# Altium schematic sheet BOWIE_MCU.SchDoc
size A; SheetNumber: 4; SheetTotal: 8
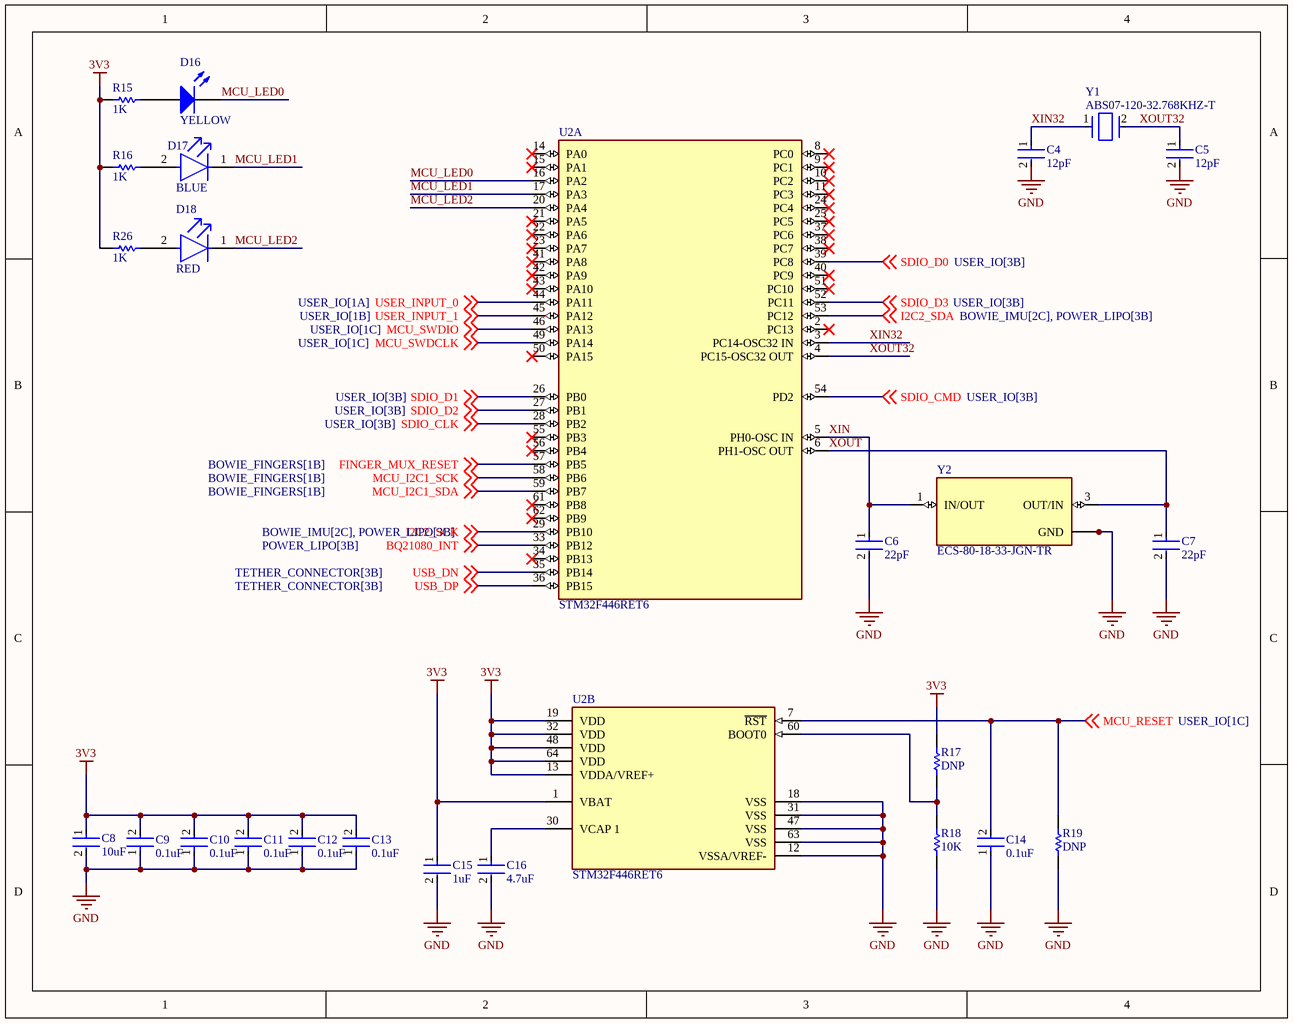
[diagram p0: BOWIE_MCU.SchDoc]

## Parts
C4  12pF  [FP-0402-L_1_0_1-W_0_5_0_1-IPC_B]
C5  12pF  [FP-0402-L_1_0_1-W_0_5_0_1-IPC_B]
C6  22pF  [FP-0402-L_1_0_1-W_0_5_0_1-MFG]
C7  22pF  [FP-0402-L_1_0_1-W_0_5_0_1-MFG]
C8  10uF  [FP-CL05A106MP5NUNC-MFG]
C9  0.1uF  [FP-CC0201-BA-MFG]
C10  0.1uF  [FP-CC0201-BA-MFG]
C11  0.1uF  [FP-CC0201-BA-MFG]
C12  0.1uF  [FP-CC0201-BA-MFG]
C13  0.1uF  [FP-CC0201-BA-MFG]
C14  0.1uF  [FP-CC0201-BA-MFG]
C15  1uF  [FP-CL511-IPC_C]
C16  4.7uF  [FP-C1005-050-0_15-MFG]
D16  YELLOW  [0603_A]
D17  BLUE  [FP-LTST-C191TBKT-MFG]
D18  RED  [FP-SML-P11UTT86-MFG]
R15  1K  [RESC1005X40X25NL05T05]
R16  1K  [RESC1005X40X25NL05T05]
R17  DNP  [RESC1005X40X25ML05T10]
R18  10K  [RESC1005X40X25ML05T10]
R19  DNP  [RESC1005X40X25NL05T10]
R26  1K  [RESC1005X40X25NL05T05]
U2  STM32F446RET6  [FP-LQFP64-5W-MFG]  (parts A,B of 2)
Y1  ABS07-120-32.768KHZ-T  [FP-ABS07-120-MFG]
Y2  ECS-80-18-33-JGN-TR  [XTAL_ECS-240-8-33-AGN-TR]

## Nets
3V3: C8.1 C9.2 C10.2 C11.2 C12.2 C13.2 C15.1 R15.1 R16.1 R17.2 R26.1 U2.1(VBAT) U2.13(VDDA/VREF+) U2.19(VDD) U2.32(VDD) U2.48(VDD) U2.64(VDD)
GND: C4.2 C5.2 C6.2 C7.2 C8.2 C9.1 C10.1 C11.1 C12.1 C13.1 C14.1 C15.2 C16.2 R18.1 R19.1 U2.12(VSSA/VREF-) U2.18(VSS) U2.31(VSS) U2.47(VSS) U2.63(VSS) Y2.2(GND) Y2.4(GND)
BQ21080_INT: U2.33(PB12) ; off-sheet BQ21080_INT
FINGER_MUX_RESET: U2.57(PB5) ; off-sheet FINGER_MUX_RESET
I2C2_SCK: U2.29(PB10) ; off-sheet I2C2_SCK
I2C2_SDA: U2.53(PC12) ; off-sheet I2C2_SDA
MCU_I2C1_SCK: U2.58(PB6) ; off-sheet MCU_I2C1_SCK
MCU_I2C1_SDA: U2.59(PB7) ; off-sheet MCU_I2C1_SDA
MCU_LED0: D16.1(K) U2.16(PA2)
MCU_LED1: D17.1(C) U2.17(PA3)
MCU_LED2: D18.1(C) U2.20(PA4)
MCU_RESET: C14.2 R19.2 U2.7(~{RST}) ; off-sheet MCU_RESET
MCU_SWDCLK: U2.49(PA14) ; off-sheet MCU_SWDCLK
MCU_SWDIO: U2.46(PA13) ; off-sheet MCU_SWDIO
SDIO_CLK: U2.28(PB2) ; off-sheet SDIO_CLK
SDIO_CMD: U2.54(PD2) ; off-sheet SDIO_CMD
SDIO_D0: U2.39(PC8) ; off-sheet SDIO_D0
SDIO_D1: U2.26(PB0) ; off-sheet SDIO_D1
SDIO_D2: U2.27(PB1) ; off-sheet SDIO_D2
SDIO_D3: U2.52(PC11) ; off-sheet SDIO_D3
USB_DN: U2.35(PB14) ; off-sheet USB_DN
USB_DP: U2.36(PB15) ; off-sheet USB_DP
USER_INPUT_0: U2.44(PA11) ; off-sheet USER_INPUT_0
USER_INPUT_1: U2.45(PA12) ; off-sheet USER_INPUT_1
XIN: C6.1 U2.5(PH0-OSC_IN) Y2.1(IN/OUT)
XIN32: C4.1 U2.3(PC14-OSC32_IN) Y1.1
XOUT: C7.1 U2.6(PH1-OSC_OUT) Y2.3(OUT/IN)
XOUT32: C5.1 U2.4(PC15-OSC32_OUT) Y1.2
NetC16_1: C16.1 U2.30(VCAP_1)
NetD16_2: D16.2(A) R15.2
NetD17_2: D17.2(A) R16.2
NetD18_2: D18.2(A) R26.2
NetR17_1: R17.1 R18.2 U2.60(BOOT0)

Not connected (* = marked no-connect by the designer): U2 2(PC13)* 8(PC0)* 9(PC1)* 10(PC2)* 11(PC3)* 14(PA0)* 15(PA1)* 21(PA5)* 22(PA6)* 23(PA7)* 24(PC4)* 25(PC5)* 34(PB13)* 37(PC6)* 38(PC7)* 40(PC9)* 41(PA8)* 42(PA9)* 43(PA10)* 50(PA15)* 51(PC10)* 55(PB3)* 56(PB4)* 61(PB8)* 62(PB9)*

## Library data of the parts
C4 C5 = CMP-1034-00771-3: General Purpose Ceramic Capacitor, 0402, 12pF, 10%, C0G, 30ppm/°C, 50V; Case/Package: 0402; Max Operating Temperature: 125°C; Tolerance: 10%; RoHS Compliant: Yes; Case Code (Imperial): 0402; Width: 0.5mm; Case Code (Metric): 1005; Radiation Hardening: No; Voltage Rating: 50V; Length: 1mm; Min Operating Temperature: -55°C; Depth: 0.5mm; Thickness: 0.022inch; Capacitance: 12pF; Packaging: Tape and Reel; Package Quantity: 10000; Mount: Surface Mount; Series: -; Construction: Flat; Dielectric: C0G; Voltage Rating (DC): 50V; Number of Pins: 2; Termination: SMD/SMT
C6 C7 = CMP-2008-02613-2: General Purpose Ceramic Capacitor, 0402, 22pF, 5%, C0G, 30ppm/°C, 50V; Temperature Coefficient: 30ppm/°C; Mount: Surface Mount; Length: 1mm; Construction: Flat; Contact Plating: Tin; REACH SVHC: No SVHC; Case/Package: 0402; Voltage: 50V; Case Code (Imperial): 0402; Thickness: 0.022inch; Radiation Hardening: No; Number of Pins: 2; Tolerance: 5%; Max Operating Temperature: 125°C; RoHS Compliant: Yes; Voltage Rating: 50V; Case Code (Metric): 1005; Package Quantity: 1; Width: 0.02inch; Termination: SMD/SMT; Lead Free: Lead Free; Height: 0.5mm; Voltage Rating (DC): 50V; Capacitance: 22pF; Min Operating Temperature: -55°C; Series: -; Depth: 0.5mm; Dielectric: C0G; Packaging: Tape and Reel
C8 = CMP-13271-000002-1: CAP CER 10UF 10V X5R 0402; Manufacturer Part Number: CL05A106MP5NUNC; Manufacturer: Samsung; Temperature Coefficient: 15%; Tolerance: 20%; Material: Ceramic; Octopart: https://octopart.com/cl05a106mp5nunc-samsung-22457395; Voltage Rating: 10V; RoHS: TRUE; Value: 10uF; Height: 0.7mm; Digikey Description: CAP CER 10UF 10V X5R 0402; Automotive: No; Package: CL05A106MP5NUNC; Device Class L1: Passive Components; Capacitance: 10uF; Temperature Range High: +85°C; ComponentLink2Description: Datasheet; Device Class L2: Capacitors; Temperature Characteristic: X5R; Temperature: -55°C to +85°C; ComponentLink2URL: http://www.samsungsem.com/kr/support/product-search/mlcc/__icsFiles/afieldfile/2019/05/10/19-CL05A106MP5NUNC.pdf; Device Class L3: Ceramic Capacitors; Category: Cap; Temperature Range Low: -55°C; Ipc Land Pattern Name: CAPC10050X50; Lead Free: Yes
C9-C14 = CMP-03422-000376-1: CAP CER 0.1UF 6.3V X5R 0201; Manufacturer: Yageo; Manufacturer Part Number: CC0201KRX5R5BB104; Tolerance: 0.1; Temperature Coefficient: 15%; Value: 100 nF; Material: Ceramic; Automotive: No; Device Class L2: Capacitors; Temperature Range High: +85°C; Capacitance: 100 nF; Temperature: -55°C to +85°C; ComponentLink2URL: http://www.yageo.com/documents/recent/UPY-GPHC_X5R_4V-to-50V_25.pdf; Category: Cap; Mouser Description: Multilayer Ceramic Capacitors MLCC - SMD/SMT 100nF 6.3V X5R 10%; Ipc Land Pattern Name: CAPC6030X30; Temperature Characteristic: X5R; Voltage Rating: 6.3 V; Lead Free: Yes; Digikey Description: CAP CER 0.1UF 6.3V X5R 0201; Device Class L1: Passive Components; Octopart: https://octopart.com/cc0201krx5r5bb104-yageo-9292636; Height: 0.33mm; Package: CC0201-BA; Footprint Url: http://www.yageo.com/exep/pages/download/literatures/UPY-C_GEN_24.pdf; ComponentLink2Description: Datasheet; Device Class L3: Ceramic Capacitors; Temperature Range Low: -55°C; RoHS: TRUE
C15 = CMP-13271-001936-1: Cap Ceramic 1uF 10V X5R ±10% SMD 0402 +85°C Paper T/R; Depth: 0.5mm; Case Code (Imperial): 0402; Material: Ceramic; Mount: Surface Mount; Thickness: 0.022inch; Dielectric: X5R; Capacitance: 1uF; Radiation Hardening: No; Case/Package: 0402; Length: 1mm; Tolerance: 10%; Max Operating Temperature: 85°C; Package Quantity: 1; Width: 0.02inch; Voltage Rating: 10V; Contact Plating: Tin; Height: 0.5mm; Min Operating Temperature: -55°C; Case Code (Metric): 1005; Packaging: Tape and Reel
C16 = CMP-2000-05997-2: CAP CER 4.7UF 10V X5R 0402; Dielectric Material: Ceramic; Tolerance: 10%; Series: C; Package Quantity: 10000; Max Operating Temperature: 85°C; Case Code (Imperial): 0402; Lead Free: Lead Free; Voltage Rating (DC): 10V; Packaging: Cut Tape; Voltage Rating: 10V; Min Operating Temperature: -55°C; Dielectric: X5R; Thickness: 0.022inch; Width: 0.02inch; Case/Package: 0402; Case Code (Metric): 1005; Capacitance: 4.7uF; Length: 0.039inch; RoHS Compliant: Yes; REACH SVHC: No SVHC; Mount: Surface Mount
D16 = CMP-1426-00005-1: SMD mono-color Chip LED, WL-SMCW, Yellow; PartNumber: 150060YS75000; Manufacturer: Wuerth Elektronik; ComponentLink1URL: http://www.we-online.com; Color: Yellow; ComponentLink2Description: Datasheet; ComponentLink2URL: http://katalog.we-online.com/led/datasheet/150060YS75000.pdf; ComponentLink1Description: Manufacturer URL; PackageReference: 0603_A
D17 = CMP-22017-000008-1: LED BLUE CLEAR CHIP SMD; Lens Color: Colorless; Dominant Wavelength: 475nm; Forward Current: 20mA; Wavelength: 468nm; Viewing Angle: 130°; Power Dissipation: 76mW; Luminous Intensity: 180mcd; Reverse Voltage: 5V; Number of Elements: 1; Lens Style: Diffused; Forward Voltage: 3.8V; Max Power Dissipation: 75mW; Case Code (Metric): 1608; Packaging: Tape and Reel; Case/Package: 0603; Depth: 1.6mm; Mount: Surface Mount; Lead Free: Lead Free; Min Operating Temperature: -20°C; Lens Transparency: Clear; Illumination Color: Blue; Height: 0.55mm; Test Current: 20mA; Case Code (Imperial): 0603; Max Operating Temperature: 80°C; Number of Pins: 2; Length: 0.8mm; Radiation Hardening: No; Package Quantity: 1; Number of LEDs: 1; Width: 0.8mm; Color: Blue
D18 = CMP-08952-000028-1: LED RED CLEAR 1006 SMD; Number of LEDs: 1; Lens Color: Colorless; Viewing Angle: 150°; Dominant Wavelength: 621nm; Luminous Intensity: 5.5mcd; Forward Voltage: 1.8V; Lens Style: Square; Test Current: 1mA; Forward Current: 20mA; Height: 0.25mm; Radiation Hardening: No; Color: Red; Case Code (Metric): 1005; Number of Pins: 2; RoHS Compliant: Yes; Max Operating Temperature: 85°C; Package Quantity: 1; Wavelength: 621nm; Lens Transparency: Clear; Packaging: Tape and Reel; Lead Free: Lead Free; Illumination Color: Red; Case/Package: 0402; Case Code (Imperial): 0402; Mount: Surface Mount; Min Operating Temperature: -40°C; Width: 0.6mm; Length: 1mm; Series: PicoLED™; REACH SVHC: No SVHC
R15 R16 R26 = CMP-1011-00510-4: Chip Resistor, 1 KOhm, +/- 1%, 100 mW, -55 to 155 degC, 0402 (1005 Metric), RoHS, Tape and Reel; PartNumber: ERJ-2RKF1001X; Manufacturer: Basic Passives; Voltage Rating: 50 V; Case\/Package: 0402; Resistance: 1 KOhm; Power Rating: 100 mW; DatasheetVersion: 04/2015; Radiation Hardening: No; Pins: 2; Height: 0.35 mm; RoHSCompliant: true; Case Code (Imperial): 0402; ComponentLink2Description: Datasheet; ComponentLink1Description: Manufacturer URL; PackageReference: 0402; Mount: Surface Mount; Package Quantity: 10000; Tolerance: 1%; ComponentLink1URL: http://www.panasonic.com/; PackageDescription: 2-Pin Surface Mount Device, Body 1 x 0.5 mm; Mounting Technology: Surface Mount; Case Code (Metric): 1005; ComponentLink2URL: http://industrial.panasonic.com/cdbs/www-data/pdf/RDA0000/AOA0000C86.pdf; REACH SVHC: Yes; Packaging: Tape and Reel; Max Operating Temperature: 155 degC; Min Operating Temperature: -55 degC; Width: 0.5 mm; Length: 1 mm
R17 R18 = CMP-2002-03043-1: Part Number: CRCW040210K0FKEDHP; Manufacturer: Vishay Dale
R19 = CMP-1011-00001-2: Manufacturer: Yageo / Phycomp; Part Number: RC0402JR-070RL
U2 = CMP-12105-000007-1: IC MCU 32BIT 512KB FLASH 64LQFP; Manufacturer: ST; Number Of Spi Channels: 4; Ram Size: 128KBytes; Standoff Height: 0.05mm; Number Of Uart Channels: 6; Number Of Pwm Channels: 32; Max Junction Temp: +105°C; Number Of I/Os: 50; Number Of Usb Channels: 2; Frequency: 180MHz; Number Of A/D Converters: 3; Max Supply Voltage: 3.6V; Number Of Adc Channels: 16; Interface: I2C,SPI,UART,USART,CAN,USB,LIN,IrDA,I2S,Other; Memory Size: 512KBytes; Number Of Timers/Counters: 14; Min Supply Voltage: 1.7V; Core Architecture: ARM Cortex-M4; Data Bus Width: 32bits; Number Of Cores: 1; Ambient Temperature Range Low: -40°C; ComponentLink2URL: https://www.st.com/en/microcontrollers-microprocessors/stm32f446re.html; Category: IC; Height: 1.6mm; Ipc Land Pattern Name: QFP50P1200X1200X160-64; Manufacturer Part Number: STM32F446RET6; Octopart: https://octopart.com/stm32f446ret6-stmicroelectronics-52642920; Temperature Range High: +105°C; Lead Free: Yes; Mouser Description: ARM Microcontrollers - MCU High-performance and DSP with FP, ARM Cortex-M4 MCU with 512 Kbytes Flash, 180 MHz CPU, Art Accelerator, SDRAM; Digikey Description: IC MCU 32BIT 512KB FLASH 64LQFP; Ambient Temperature Range High: +85°C; Number Of I2C Channels: 4; Memory Type: FLASH; RoHS: TRUE; Automotive: No; Device Class L1: Integrated Circuits (ICs); Temperature: -40°C to +105°C; Device Class L2: Embedded Processors and Controllers; Device Class L3: Microcontrollers; Temperature Range Low: -40°C; Package: LQFP64-5W; ComponentLink2Description: Datasheet
Y1 = CMP-2000-07587-2: CRYSTAL 32.7680KHZ 6PF SMD; Frequency Tolerance: 20ppm; Series Resistance: 60kR; ESR (Equivalent Series Resistance): 55kR; Depth: 1.5mm; Width: 0.061inch; Number of Pins: 2; Max Operating Temperature: 85°C; Length: 3.2mm; Case/Package: SMD/SMT; Series: ABS07; Lead Free: Lead Free; Min Operating Temperature: -40°C; Load Capacitance: 6pF; Packaging: Tape and Reel; Height: 0.035inch; Radiation Hardening: No; Tolerance: 20ppm; Operating Frequency: 32.768 kHz; Termination: SMD/SMT; REACH SVHC: No SVHC; RoHS Compliant: Yes; Frequency: 32.768kHz; Package Quantity: 3000; Mount: Surface Mount
Y2 = ECS-80-18-33-JGN-TR: The sub miniature ECX-32 is a compact SMD Crystal. The 3.2 x 2.5 x 0.8 mm ceramic package is ideal for todayâ€™s SMD manufacturing environment.; MF: {'manufacturer': u'ECS Inc.'}; Price: None; Value: *; Package: None; Availability: Unavailable; MP: ECS-80-18-33-JGN-TR